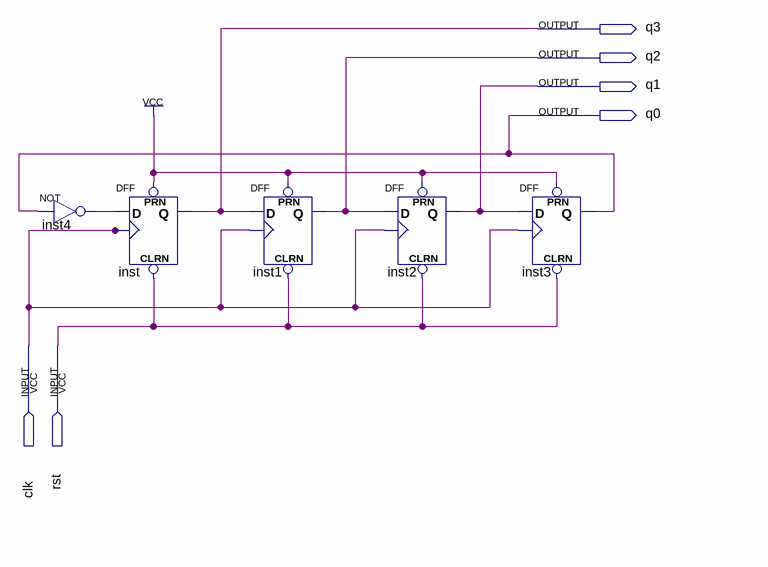
[diagram p0: schematic sheet]
// Quartus schematic SynchronousDownCounter.bdf as structural Verilog: 5 symbols, 6 pins
module SynchronousDownCounter (
  input  clk,
  input  rst,
  output q3,
  output q2,
  output q1,
  output q0
);

  wire inst4_out;

  not inst4 (inst4_out, q0);
  DFF inst (.CLRN(rst), .CLK(clk), .D(inst4_out), .PRN(1'b1), .Q(q3));
  DFF inst1 (.CLRN(rst), .CLK(clk), .D(q3), .PRN(1'b1), .Q(q2));
  DFF inst2 (.CLRN(rst), .CLK(clk), .D(q2), .PRN(1'b1), .Q(q1));
  DFF inst3 (.CLRN(rst), .CLK(clk), .D(q1), .PRN(1'b1), .Q(q0));
endmodule
